# EAGLE design 4layer_test (EAGLE 9.2.2)
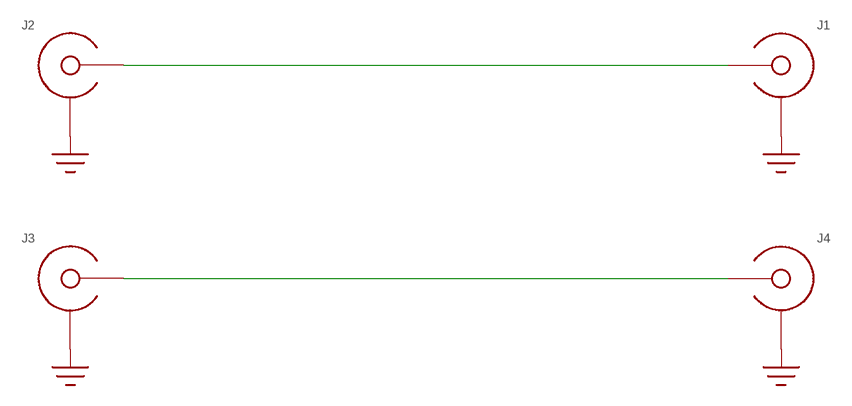
[diagram p0: schematic, sheet 1]

## Parts
J1  SMA_END_LAUNCH4L  [SMA_EDGE_LAUNCH]
J2  SMA_END_LAUNCH4L  [SMA_EDGE_LAUNCH]
J3  SMA_END_LAUNCH4L  [SMA_EDGE_LAUNCH]
J4  SMA_END_LAUNCH4L  [SMA_EDGE_LAUNCH]

## Nets
GND: J1.BOTTOM_PAD(SHIELD) J1.GND@1(SHIELD) J1.GND@2(SHIELD) J1.GND@3(SHIELD) J1.GND@4(SHIELD) J1.GND@5(SHIELD) J1.GND@6(SHIELD) J1.GND@7(SHIELD) J1.GND@8(SHIELD) J1.GND@14(SHIELD) J1.GND@15(SHIELD) J1.GND@16(SHIELD) J1.GND@17(SHIELD) J1.GND_PAD1(SHIELD) J1.GND_PAD2(SHIELD) J2.BOTTOM_PAD(SHIELD) J2.GND@1(SHIELD) J2.GND@2(SHIELD) J2.GND@3(SHIELD) J2.GND@4(SHIELD) J2.GND@5(SHIELD) J2.GND@6(SHIELD) J2.GND@7(SHIELD) J2.GND@8(SHIELD) J2.GND@14(SHIELD) J2.GND@15(SHIELD) J2.GND@16(SHIELD) J2.GND@17(SHIELD) J2.GND_PAD1(SHIELD) J2.GND_PAD2(SHIELD) J3.BOTTOM_PAD(SHIELD) J3.GND@1(SHIELD) J3.GND@2(SHIELD) J3.GND@3(SHIELD) J3.GND@4(SHIELD) J3.GND@5(SHIELD) J3.GND@6(SHIELD) J3.GND@7(SHIELD) J3.GND@8(SHIELD) J3.GND@14(SHIELD) J3.GND@15(SHIELD) J3.GND@16(SHIELD) J3.GND@17(SHIELD) J3.GND_PAD1(SHIELD) J3.GND_PAD2(SHIELD) J4.BOTTOM_PAD(SHIELD) J4.GND@1(SHIELD) J4.GND@2(SHIELD) J4.GND@3(SHIELD) J4.GND@4(SHIELD) J4.GND@5(SHIELD) J4.GND@6(SHIELD) J4.GND@7(SHIELD) J4.GND@8(SHIELD) J4.GND@14(SHIELD) J4.GND@15(SHIELD) J4.GND@16(SHIELD) J4.GND@17(SHIELD) J4.GND_PAD1(SHIELD) J4.GND_PAD2(SHIELD)
N$1: J1.CENTER@1(CENTER) J1.CENTER@2(CENTER) J2.CENTER@1(CENTER) J2.CENTER@2(CENTER)
N$2 [31.3-7]: J3.CENTER@1(CENTER) J3.CENTER@2(CENTER) J4.CENTER@1(CENTER) J4.CENTER@2(CENTER)

## Library data of the parts
J1-J4 = yapo:SMA_END_LAUNCH

## Net classes
1 31.3-7: width 0.333 mm, clearance 0.178 mm

## Board
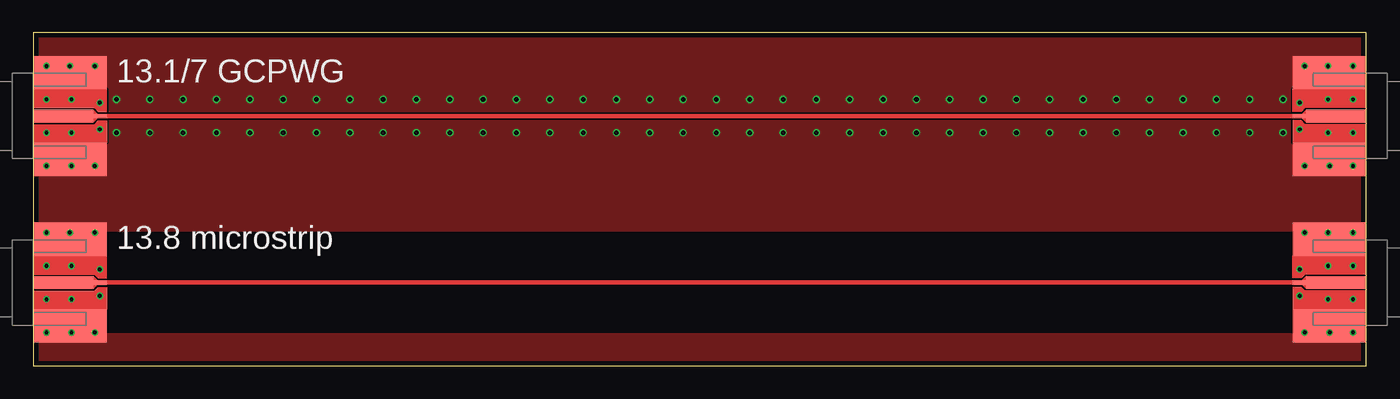
[diagram p1: board, top side]
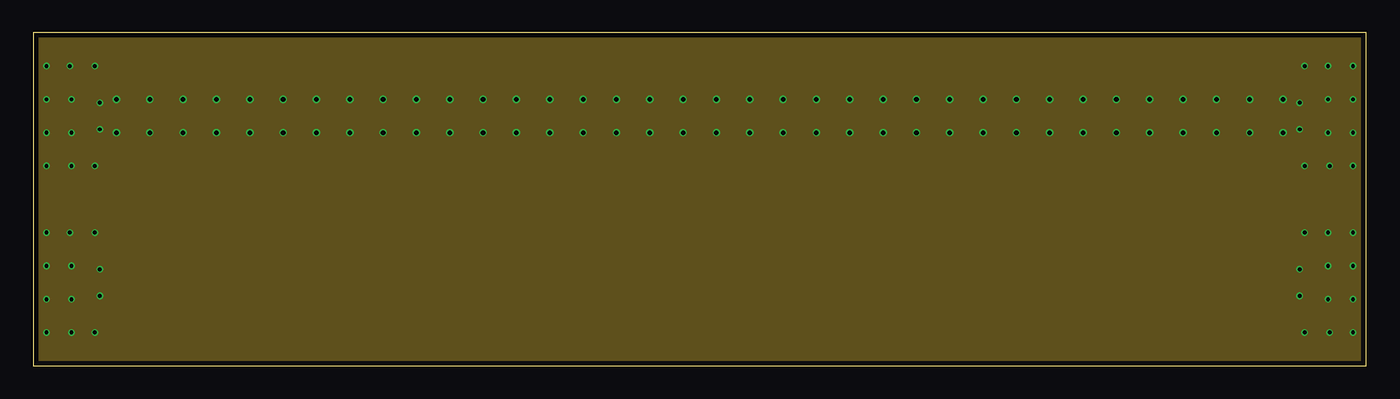
[diagram p2: board, inner layer Route2]
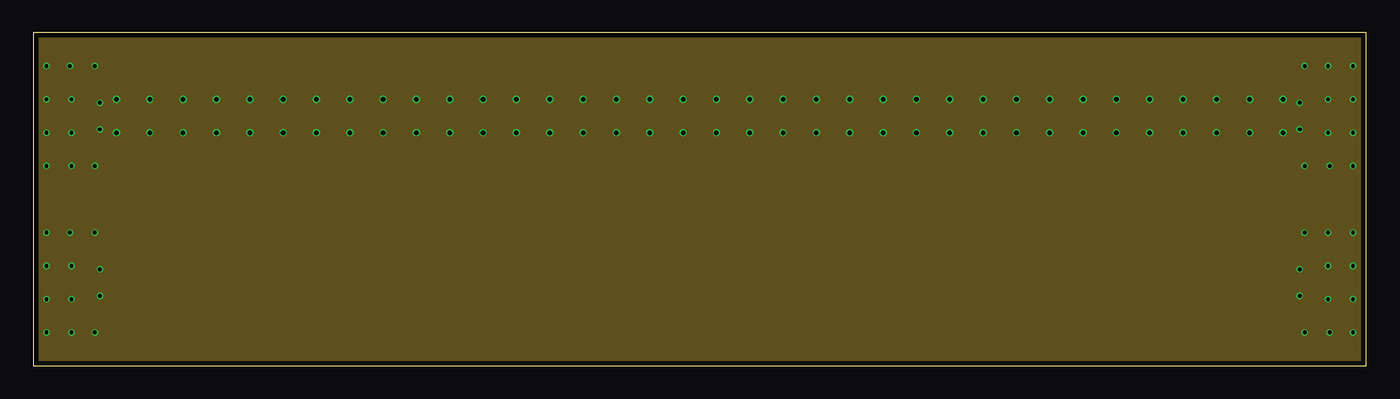
[diagram p3: board, inner layer Route15]
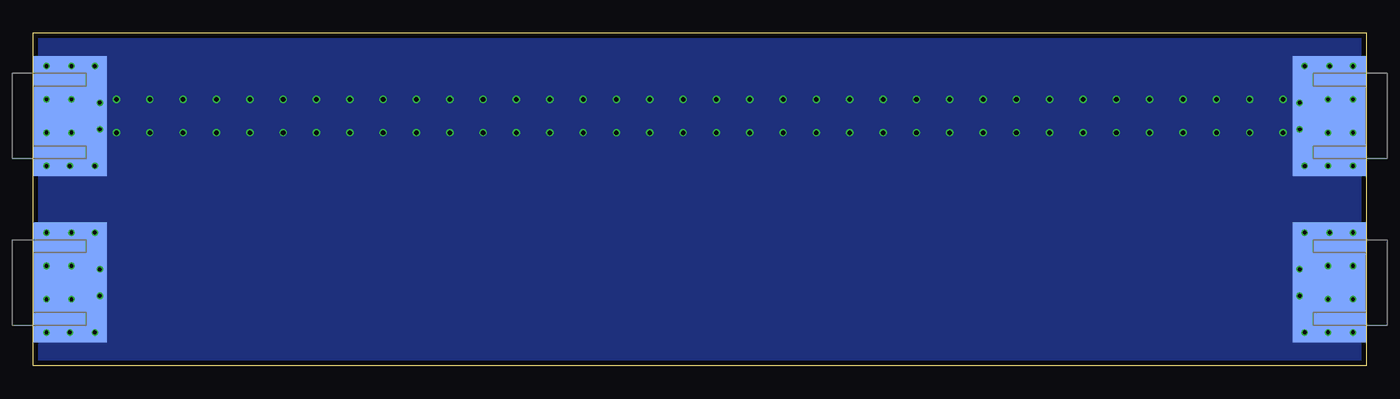
[diagram p4: board, bottom side, seen from below]

Size 101.6 x 25.4 mm. Coordinates in mm from the lower left corner, seen from the top.
Outline: 0,0 101.6,0 101.6,25.4 0,25.4 0,0
Copper layers (1*2*15*16): Top 0.035559375mm / dielectric 0.17018125mm / Route2 0.01778125mm / dielectric 47mil / Route15 0.01778125mm / dielectric 0.17018125mm / Bottom 0.035559375mm
Design rules "oshpark-4layer": minimum track width 5mil, minimum drill 10mil, track to track 5mil, track to pad 5mil, pad to pad 5mil, via to via 5mil, smd to smd 5mil, copper to edge 15mil, drill to drill 6mil, minimum pad ring 4mil, minimum via ring 4mil, stop-mask expansion 2.5mil, vias tented up to drill 0mil, thermal gap 10mil
tRestrict: area 5.1,2.5 to 96.5,10.2

### Footprints (pad centres in the part's own frame; a part is rotated, then mirrored left to right if it is on the bottom)
SMA_EDGE_LAUNCH = smd 5.588 x 9.144 bottom: BOTTOM_PAD 2.794,0 | smd 4.572 x 0.965: CENTER@1 2.286,0 | smd 1.016 x 0.33: CENTER@2 5.08,0 | drill 0.3: GND@1 1.016,3.81; GND@2 4.699,3.81; GND@3 1.016,1.27; GND@4 5.08,1.016; GND@5 1.016,-1.27; GND@6 5.08,-1.016; GND@7 1.016,-3.81; GND@8 4.699,-3.81; GND@14 2.794,3.81; GND@15 2.921,-3.81; GND@16 2.921,-1.27; GND@17 2.921,1.27 | smd 5.588 x 2.54: GND_PAD1 2.794,3.302; GND_PAD2 2.794,-3.302

### Placement (x,y rotation side)
J1  101.6,6.35 180 top
J2  0,6.35 0 top
J3  101.6,19.05 180 top
J4  0,19.05 0 top

### Tracks (layer width: path | path; a pad name or v marks a point on that pad's centre or on a via)
GND  (via drill 0.35)
  other vias: 6.35,17.78 8.89,17.78 11.43,17.78 13.97,17.78 16.51,17.78 19.05,17.78 21.59,17.78 24.13,17.78 26.67,17.78 29.21,17.78 31.75,17.78 34.29,17.78 36.83,17.78 39.37,17.78 41.91,17.78 44.45,17.78 46.99,17.78 49.53,17.78 52.07,17.78 54.61,17.78 57.15,17.78 59.69,17.78 62.23,17.78 64.77,17.78 67.31,17.78 69.85,17.78 72.39,17.78 74.93,17.78 77.47,17.78 80.01,17.78 82.55,17.78 85.09,17.78 87.63,17.78 90.17,17.78 92.71,17.78 95.25,17.78 6.35,20.32 8.89,20.32 11.43,20.32 13.97,20.32 16.51,20.32 19.05,20.32 21.59,20.32 24.13,20.32 26.67,20.32 29.21,20.32 31.75,20.32 34.29,20.32 36.83,20.32 39.37,20.32 41.91,20.32 44.45,20.32 46.99,20.32 49.53,20.32 52.07,20.32 54.61,20.32 57.15,20.32 59.69,20.32 62.23,20.32 64.77,20.32 67.31,20.32 69.85,20.32 72.39,20.32 74.93,20.32 77.47,20.32 80.01,20.32 82.55,20.32 85.09,20.32 87.63,20.32 90.17,20.32 92.71,20.32 95.25,20.32
  pour Top (no thermals): 0,0 101.6,0 101.6,25.4 0,25.4
  pour Route2 (no thermals): 0,0 101.6,0 101.6,25.4 0,25.4
  pour Route15 (no thermals): 0,0 101.6,0 101.6,25.4 0,25.4
  pour Bottom (no thermals): 0,0 101.6,0 101.6,25.4 0,25.4
N$1
  Top 0.351: J2.CENTER@1 J2.CENTER@2 J1.CENTER@2 J1.CENTER@1
N$2
  Top 0.333: J4.CENTER@1 J4.CENTER@2 J3.CENTER@2 J3.CENTER@1

### Text on the board
tPlace: 13.1/7 GCPWG | 13.8 microstrip